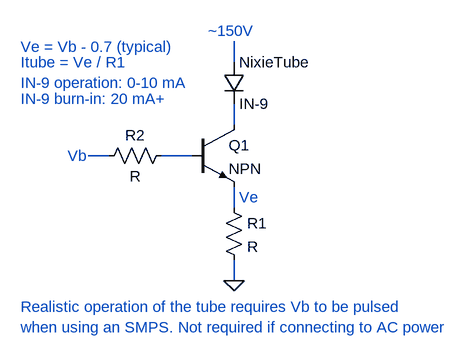
[diagram p0: schematic TubeDriverDemo.asc]
TubeDriverDemo.asc, the LTspice schematic file:
Version 4
SHEET 1 880 680
WIRE 240 0 240 -32
WIRE 240 96 240 64
WIRE 48 144 16 144
WIRE 176 144 128 144
WIRE 240 224 240 192
WIRE 240 336 240 304
FLAG 240 336 0
SYMBOL npn 176 96 R0
SYMATTR InstName Q1
SYMBOL res 224 208 R0
SYMATTR InstName R1
SYMBOL res 144 128 R90
WINDOW 0 0 56 VBottom 2
WINDOW 3 32 56 VTop 2
SYMATTR InstName R2
SYMBOL diode 224 0 R0
SYMATTR InstName NixieTube
SYMATTR Value IN-9
TEXT -16 144 Left 2 ;Vb
TEXT 248 208 Left 2 ;Ve
TEXT 200 -48 Left 2 ;~150V
TEXT -88 -24 Left 2 ;Ve = Vb - 0.7 (typical)
TEXT -88 0 Left 2 ;Itube = Ve / R1
TEXT -88 32 Left 2 ;IN-9 operation: 0-10 mA
TEXT -88 56 Left 2 ;IN-9 burn-in: 20 mA+
TEXT -88 376 Left 2 ;Realistic operation of the tube requires Vb to be pulsed
TEXT -88 408 Left 2 ;when using an SMPS. Not required if connecting to AC power

The netlist it stands for:
* TubeDriverDemo.asc
Q1 N002 N004 N005 0 NPN
R1 N005 0 R
R2 N004 N003 R
D§NixieTube N001 N002 IN-9
.model D D
.lib standard.dio
.model NPN NPN
.model PNP PNP
.lib standard.bjt
* Vb
* Ve
* ~150V
* Ve = Vb - 0.7 (typical)
* Itube = Ve / R1
* IN-9 operation: 0-10 mA
* IN-9 burn-in: 20 mA+
* Realistic operation of the tube requires Vb to be pulsed
* when using an SMPS. Not required if connecting to AC power
.backanno
.end